# Altium schematic sheet AE_Circuit.SchDoc
size A4
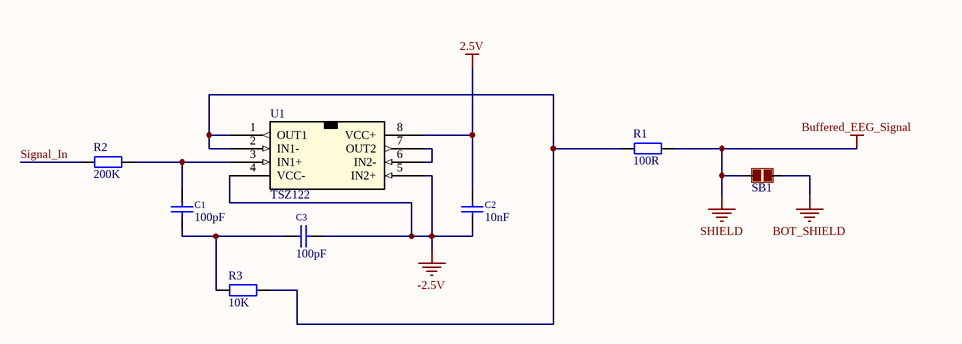
[diagram p0: AE_Circuit.SchDoc]

## Parts
C1  100pF  [SMD0603-1608]
C2  10nF  [SMD0603-1608]
C3  100pF  [SMD0603-1608]
R1  100R  [SMD0603-1608]
R2  200K  [SMD0603-1608]
R3  10K  [SMD0603-1608]
SB1  Solder Jumper  [SJB_2_0603]  (value not drawn)
U1  TSZ122  [TSOP8 (miniSO8)]

## Nets
2.5V: C2.1 U1.8(VCC+)
-2.5V: C2.2 C3.2 U1.4(VCC-) U1.5(IN2+)
BOT_SHIELD: SB1.2
Buffered_EEG_Signal: R1.2 SB1.1  [also labelled SHIELD]
Signal_In: R2.1
NetC1_1: C1.1 R2.2 U1.3(IN1+)
NetC1_2: C1.2 C3.1 R3.1
NetR1_1: R1.1 R3.2 U1.1(OUT1) U1.2(IN1-)
NetU1_6: U1.6(IN2-) U1.7(OUT2)

## Library data of the parts
C1-C3 = Capacitor: AEMS Code: 2100341; Vendor: Digikey; Volt: 16V; Published: 13-April-2009; Publisher: Hoang Nguyen; ComponentLink1Description: Digikey Part Link; ComponentLink2Description: Open Datasheet; ComponentLink2URL: H:\LIBRARY\LIBRARY.Datasheet\
  C1 C3: Value: 100pF
  C2: Value: 10nF
R1-R3 = Resistor SMD: Value: 1K
SB1 = SJB_SMD_2_0603
U1 = TSZ122: TSZ122-Dual precision amplifier; Manufacturer: Texas Instruments; GENERIC_PART_NUMBER: OPA2333; Manufacturer_Part_Number: opa2333_dgk_8; INDUSTRY_STD_PKG_TYPE: MSOP; FAMILY_NAME: LOW OFFSET VOLTAGE; PIN_COUNT: 8; PACKAGE_DESIGNATOR: DGK; Datasheet_URL: http://www.ti.com/lit/gpn/OPA2333; Vendor: Texas Instruments; Value: Value; Type: Type; RefDes: RefDes